# Altium schematic sheet Microprocessor Power.SchDoc
size B; Organization: The Pennsylvania State University - Applied Research Laboratory; DocumentNumber: 8; SheetNumber: 8; SheetTotal: 14; PageSetup: Record=PageOptions|CenterHorizontal=True|CenterVertical=True|PrintScale=0.99|XCorrection=1.00|YCorrection=1.00|PrintKind=1|BorderSize=5000000|LeftOffset=0|BottomOffset=0|Orientation=2|PaperLength=1000|PaperWidth=1000|Scale=100|PaperSource=7|PrintQuality=-4|MediaType=1|DitherType=10|PaperKind=Tabloid (11 x 17")|PrintScaleMode=1; SCHEMATIC_SHEET_TITLE: MICROPROCESSOR POWER; PAGE_TITLE: -
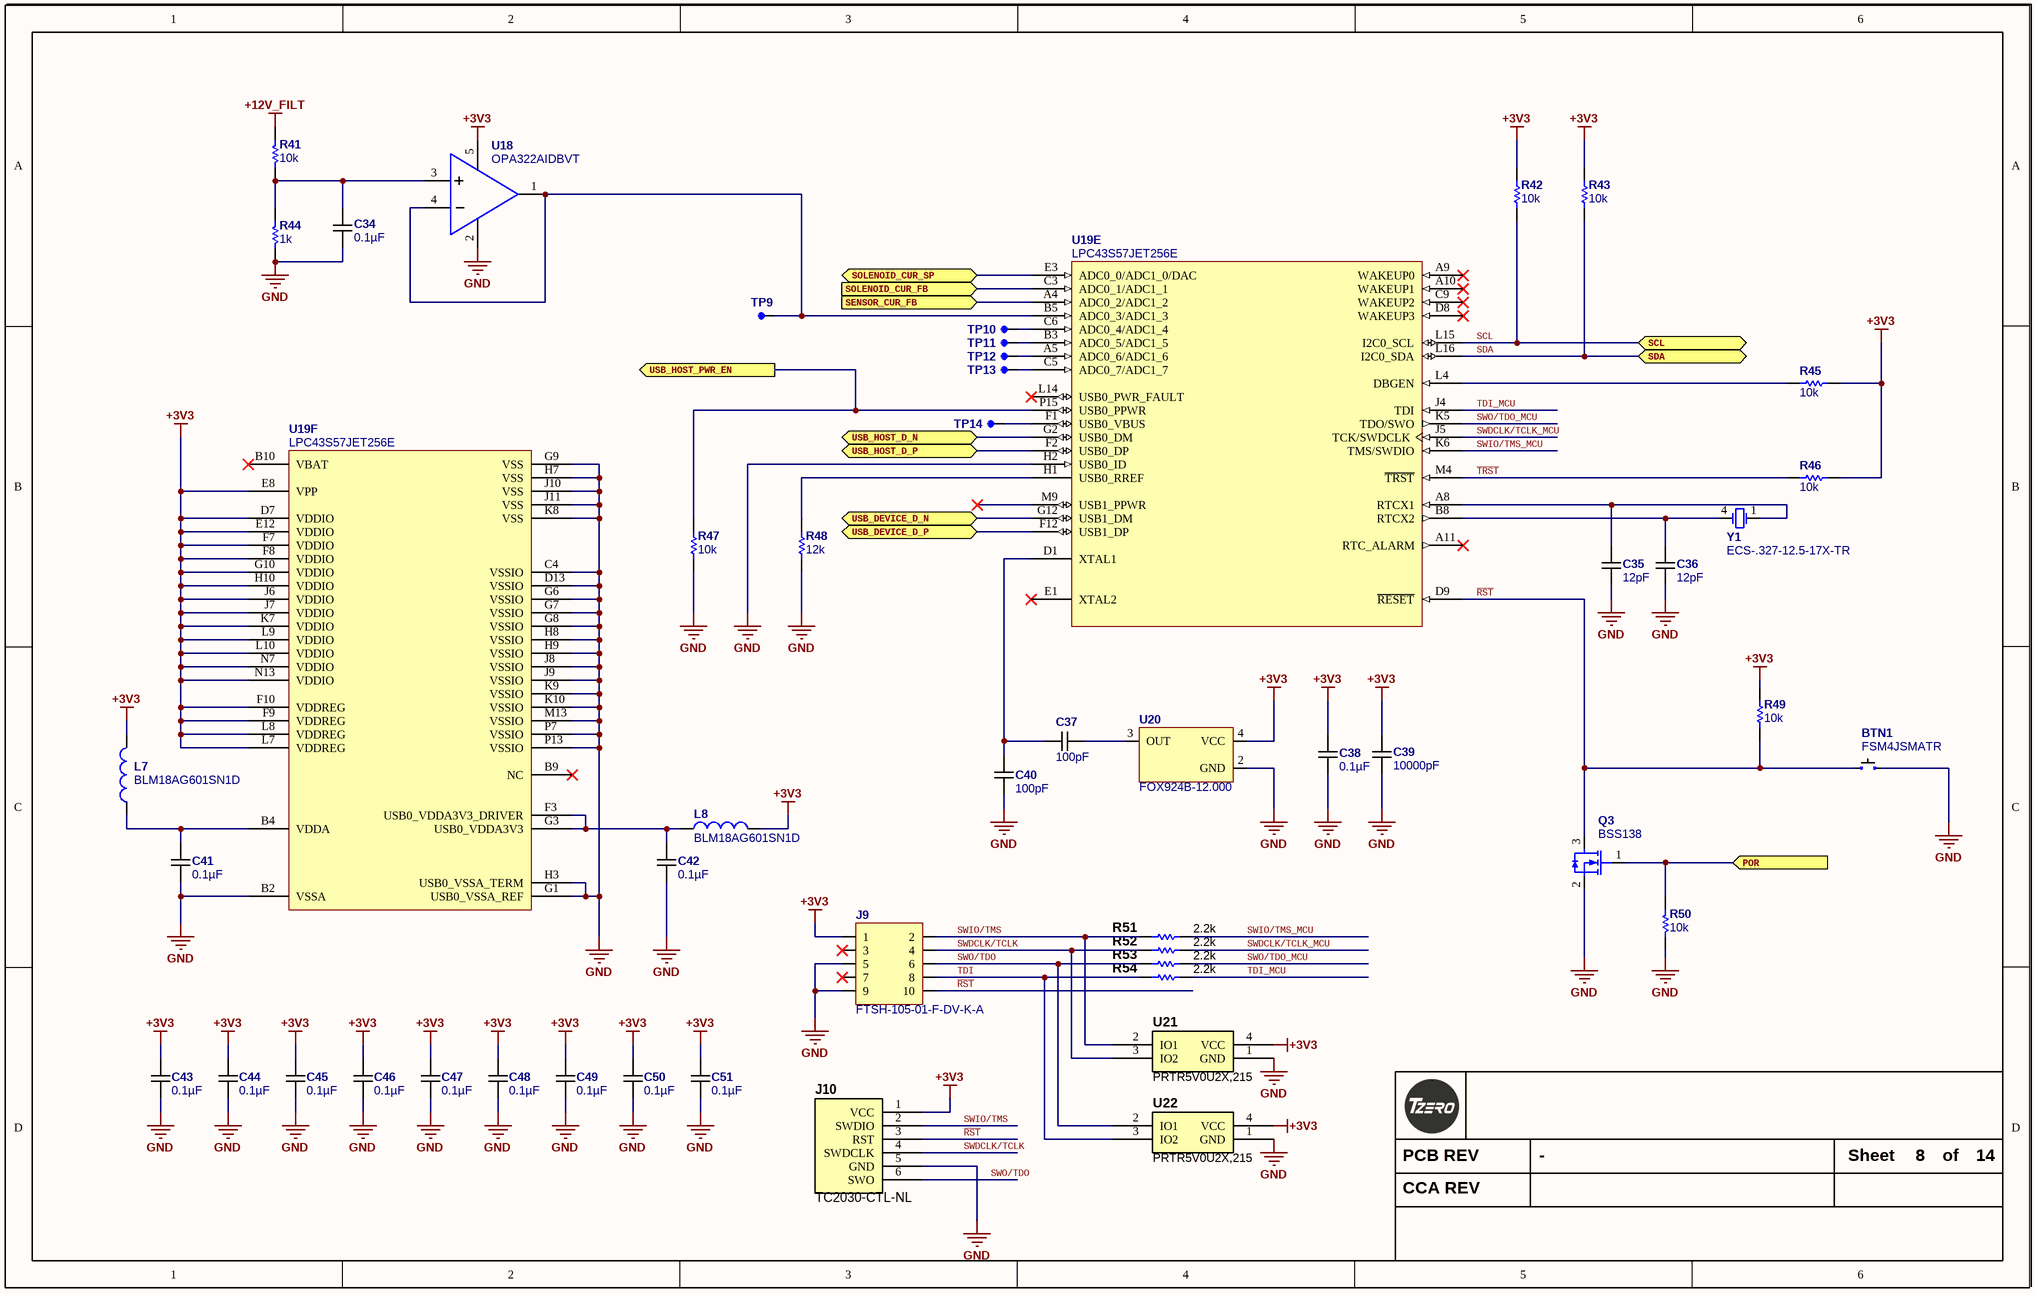
[diagram p0: Microprocessor Power.SchDoc]

## Parts
BTN1  FSM4JSMATR  [FSM4JSMA]
C34  0.1µF  [C0402_0.55MM_HD]
C35  12pF  [C0603_0.90MM_HD]
C36  12pF  [C0603_0.90MM_HD]
C37  100pF  [C0603_0.95MM_HD]
C38  0.1µF  [C0402_0.55MM_HD]
C39  10000pF  [C0603_0.90MM_HD]
C40  100pF  [C0603_0.95MM_HD]
C41  0.1µF  [C0402_0.55MM_HD]
C42  0.1µF  [C0402_0.55MM_HD]
C43  0.1µF  [C0402_0.55MM_HD]
C44  0.1µF  [C0402_0.55MM_HD]
C45  0.1µF  [C0402_0.55MM_HD]
C46  0.1µF  [C0402_0.55MM_HD]
C47  0.1µF  [C0402_0.55MM_HD]
C48  0.1µF  [C0402_0.55MM_HD]
C49  0.1µF  [C0402_0.55MM_HD]
C50  0.1µF  [C0402_0.55MM_HD]
C51  0.1µF  [C0402_0.55MM_HD]
J9  FTSH-105-01-F-DV-K-A  [FTSH-105-01-F-DV-K-A]
J10  TC2030‐CTL‐NL  [TC2030]  (no BOM)
L7  BLM18AG601SN1D  [L_0603_0.8mm]
L8  BLM18AG601SN1D  [L_0603_0.8mm]
Q3  BSS138  [SOT23_Medium]
R41  10k  [R0603_0.55MM_MD]
R42  10k  [R0603_0.55MM_HD]
R43  10k  [R0603_0.55MM_HD]
R44  1k  [R0603_0.55MM_MD]
R45  10k  [R0603_0.55MM_HD]
R46  10k  [R0603_0.55MM_HD]
R47  10k  [R0603_0.55MM_MD]
R48  12k  [R0603_0.55MM_HD]
R49  10k  [R0603_0.55MM_HD]
R50  10k  [R0603_0.55MM_HD]
R51  2.2k  [R0603_0.55MM_MD]
R52  2.2k  [R0603_0.55MM_MD]
R53  2.2k  [R0603_0.55MM_MD]
R54  2.2k  [R0603_0.55MM_MD]
TP9  (no value)  [TP_SMT_25_MIL_ROUND]  (net tie, no BOM)
TP10  (no value)  [TP_SMT_25_MIL_ROUND]  (net tie, no BOM)
TP11  (no value)  [TP_SMT_25_MIL_ROUND]  (net tie, no BOM)
TP12  (no value)  [TP_SMT_25_MIL_ROUND]  (net tie, no BOM)
TP13  (no value)  [TP_SMT_25_MIL_ROUND]  (net tie, no BOM)
TP14  (no value)  [TP_SMT_25_MIL_ROUND]  (net tie, no BOM)
U18  OPA322AIDBVT  [SOT23-5]
U19  LPC43S57JET256E  [LBGA256 16X16 1700X1700X155]  (parts E,F of 10)
U20  FOX924B-12.000  [FOX924]
U21  PRTR5V0U2X,215  [SOT143B]
U22  PRTR5V0U2X,215  [SOT143B]
Y1  ECS-.327-12.5-17X-TR  [ECX-306]

## Ports
POR (in), SCL (bidir), SDA (bidir), SENSOR_CUR_FB (in), SOLENOID_CUR_FB (in), SOLENOID_CUR_SP (bidir), USB_DEVICE_D_N (bidir), USB_DEVICE_D_P (bidir), USB_HOST_D_N (bidir), USB_HOST_D_P (bidir), USB_HOST_PWR_EN (out)

## Nets
+3V3: C38.2 C39.2 C43.2 C44.2 C45.2 C46.2 C47.2 C48.2 C49.2 C50.2 C51.2 J9.1 J10.1(VCC) L7.2 L8.2 R42.1 R43.1 R45.2 R46.2 R49.2 U18.5(VCC) U19.D7(VDDIO) U19.E8(VPP) U19.E12(VDDIO) U19.F7(VDDIO) U19.F8(VDDIO) U19.F9(VDDREG) U19.F10(VDDREG) U19.G10(VDDIO) U19.H10(VDDIO) U19.J6(VDDIO) U19.J7(VDDIO) U19.K7(VDDIO) U19.L7(VDDREG) U19.L8(VDDREG) U19.L9(VDDIO) U19.L10(VDDIO) U19.N7(VDDIO) U19.N13(VDDIO) U20.4(VCC) U21.4(VCC) U22.4(VCC)
+12V_FILT: R41.2
GND: BTN1.B C34.1 C35.1 C36.1 C38.1 C39.1 C40.2 C41.1 C42.1 C43.1 C44.1 C45.1 C46.1 C47.1 C48.1 C49.1 C50.1 C51.1 J9.5 J9.9 J10.5(GND) Q3.2(S) R44.2 R47.2 R48.2 R50.1 U18.2(GND) U19.B2(VSSA) U19.C4(VSSIO) U19.D13(VSSIO) U19.G1(USB0_VSSA_REF) U19.G6(VSSIO) U19.G7(VSSIO) U19.G8(VSSIO) U19.G9(VSS) U19.H2(USB0_ID) U19.H3(USB0_VSSA_TERM) U19.H7(VSS) U19.H8(VSSIO) U19.H9(VSSIO) U19.J8(VSSIO) U19.J9(VSSIO) U19.J10(VSS) U19.J11(VSS) U19.K8(VSS) U19.K9(VSSIO) U19.K10(VSSIO) U19.M13(VSSIO) U19.P7(VSSIO) U19.P13(VSSIO) U20.2(GND) U21.1(GND) U22.1(GND)
~{RST}: BTN1.A J9.10 J10.3(RST) Q3.3(D) R49.1 U19.D9(~{RESET})
~{TRST}: R46.1 U19.M4(~{TRST})
POR: Q3.1(G) R50.2 ; port POR
SCL: R42.2 U19.L15(I2C0_SCL) ; port SCL
SDA: R43.2 U19.L16(I2C0_SDA) ; port SDA
SENSOR_CUR_FB: U19.A4(ADC0_2/ADC1_2) ; port SENSOR_CUR_FB
SOLENOID_CUR_FB: U19.C3(ADC0_1/ADC1_1) ; port SOLENOID_CUR_FB
SOLENOID_CUR_SP: U19.E3(ADC0_0/ADC1_0/DAC) ; port SOLENOID_CUR_SP
SWDCLK/TCLK: J9.4 J10.4(SWDCLK) R52.1 U21.3(IO2)
SWDCLK/TCLK_MCU: R52.2 U19.J5(TCK/SWDCLK)
SWIO/TMS: J9.2 J10.2(SWDIO) R51.1 U21.2(IO1)
SWIO/TMS_MCU: R51.2 U19.K6(TMS/SWDIO)
SWO/TDO: J9.6 J10.6(SWO) R53.1 U22.2(IO1)
SWO/TDO_MCU: R53.2 U19.K5(TDO/SWO)
TDI: J9.8 R54.1 U22.3(IO2)
TDI_MCU: R54.2 U19.J4(TDI)
USB_DEVICE_D_N: U19.G12(USB1_DM) ; port USB_DEVICE_D_N
USB_DEVICE_D_P: U19.F12(USB1_DP) ; port USB_DEVICE_D_P
USB_HOST_D_N: U19.G2(USB0_DM) ; port USB_HOST_D_N
USB_HOST_D_P: U19.F2(USB0_DP) ; port USB_HOST_D_P
USB_HOST_PWR_EN: R47.1 U19.P15(USB0_PPWR) ; port USB_HOST_PWR_EN
NetC34_2: C34.2 R41.1 R44.1 U18.3(+)
NetC35_2: C35.2 U19.A8(RTCX1) Y1.1(OSC1)
NetC36_2: C36.2 U19.B8(RTCX2) Y1.4(OSC2)
NetC37_1: C37.1 U20.3(OUT)
NetC37_2: C37.2 C40.1 U19.D1(XTAL1)
NetC41_2: C41.2 L7.1 U19.B4(VDDA)
NetC42_2: C42.2 L8.1 U19.F3(USB0_VDDA3V3_DRIVER) U19.G3(USB0_VDDA3V3)
NetR45_1: R45.1 U19.L4(DBGEN)
NetR48_1: R48.1 U19.H1(USB0_RREF)
NetTP9_1: TP9.1 U18.1(OUT) U18.4(-) U19.B5(ADC0_3/ADC1_3)
NetTP10_1: TP10.1 U19.C6(ADC0_4/ADC1_4)
NetTP11_1: TP11.1 U19.B3(ADC0_5/ADC1_5)
NetTP12_1: TP12.1 U19.A5(ADC0_6/ADC1_6)
NetTP13_1: TP13.1 U19.C5(ADC0_7/ADC1_7)
NetTP14_1: TP14.1 U19.F1(USB0_VBUS)

Not connected (* = marked no-connect by the designer): J9 3* 7*; U19 A9(WAKEUP0)* A10(WAKEUP1)* A11(RTC_ALARM)* B9(NC)* B10(VBAT)* C9(WAKEUP2)* D8(WAKEUP3)* E1(XTAL2)* L14(USB0_PWR_FAULT)* M9(USB1_PPWR)*

## Notes on the sheet
- PCB REV
- Sheet
- of
- CCA REV

## Library data of the parts
BTN1 = FSM4JSMATR: SWITCH TACTILE SPST-NO 0.05A 12V; Manufacturer: TE Connectivity; Switch Function: Off-Mom; Contact Rating @ Voltage: 0.05A @ 12VDC; Actuator Type: Standard; Actuator Orientation: Top Actuated; Outline: 6.00mm x 6.00mm; Illumination: Non-Illuminated; Operating Force: 160gf; Supplier 1: Digi-Key; Supplier Part Number 1: 450-1759-1-ND; Manufacturer Part Number: FSM4JSMATR; RoHS: RoHS Compliant; Category: Switches; Stock 1: 35617; Pricing 1: 1=0.36, 10=0.34, 25=0.2912, 50=0.2474, 100=0.2377, 250=0.21344, 500=0.20374 (USD); Circuit: SPST-NO; Mounting Type: Surface Mount; Termination Style: Gull Wing; Packaging: Cut Tape (CT); ComponentLink1URL: http://documents.tycoelectronics.com/commerce/DocumentDelivery/DDEController?Action=srchrtrv&DocNm=2-1437565-7&DocType=CD&DocLang=EN; ComponentLink1Description: http://documents.tycoelectronics.com/commerce/DocumentDelivery/DDEController?Action=srchrtrv&DocNm=2-1437565-7&DocType=CD&DocLang=EN; Value: FSM4JSMATR
C34 C38 C41-C51 = CGA2B3X7R1E104K050BB: CAP CER 0.1UF 25V X7R 0402; Manufacturer: TDK Corporation; Tolerance: ±10%; Substitution Notes: 0.1µF , 25V , ±10% , X7R , -55°C ~ 125°C , AEC-Q200 , 0402; Value: 0.1µF; Temperature Coefficient: X7R; Manufacturer Part Number: CGA2B3X7R1E104K050BB; ComponentLink1Description: Datasheet (Internal); ComponentLink1URL: datasheets\TDK\mlcc_automotive_general_en.pdf; ComponentLink2Description: Datasheet (External); ComponentLink2URL: https://product.tdk.com/info/en/catalog/datasheets/mlcc_automotive_general_en.pdf; Supplier 1: Digikey; Supplier Part Number 1: 445-6902-1-ND; Category: Capacitors; Voltage - Rated: 25V; Features: -; Operating Temperature: -55°C ~ 125°C; Ratings: AEC-Q200; Package: 0402; Thickness (Max): 0.55MM
C35 C36 = CGA3E2C0G1H120J080AA: CAP CER 12PF 50V C0G 0603; Manufacturer: TDK Corporation; Temperature Coefficient: C0G, NP0; Tolerance: ±5%; Substitution Notes: 12pF , 50V , ±5% , C0G, NP0 , -55°C ~ 125°C , AEC-Q200 , 0603; Value: 12pF; Manufacturer Part Number: CGA3E2C0G1H120J080AA; ComponentLink1Description: Datasheet (Internal); ComponentLink1URL: datasheets\TDK\mlcc_automotive_general_en.pdf; ComponentLink2Description: Datasheet (External); ComponentLink2URL: https://product.tdk.com/info/en/catalog/datasheets/mlcc_automotive_general_en.pdf; Supplier 1: Digikey; Supplier Part Number 1: 445-5629-1-ND; Category: Capacitors; Voltage - Rated: 50V; Operating Temperature: -55°C ~ 125°C; Ratings: AEC-Q200; Package: 0603; Thickness (Max): 0.90MM; Features: -
C37 C40 = CGA3E2C0G1H101J080AE: CAP CER 100PF 50V NP0 0603; Manufacturer: TDK Corporation; Temperature Coefficient: C0G, NP0; Tolerance: ±5%; Substitution Notes: 100pF , 50V , ±5% , C0G, NP0 , -55°C ~ 125°C , AEC-Q200 , 0603; Value: 100pF; Manufacturer Part Number: CGA3E2C0G1H101J080AE; ComponentLink1Description: Datasheet (Internal); ComponentLink1URL: datasheets\TDK\mlcc_automotive_general_en.pdf; ComponentLink2Description: Datasheet (External); ComponentLink2URL: https://product.tdk.com/info/en/catalog/datasheets/mlcc_automotive_general_en.pdf; Supplier 1: Digikey; Supplier Part Number 1: 445-173653-1-ND; Category: Capacitors; Voltage - Rated: 50V; Operating Temperature: -55°C ~ 125°C; Ratings: AEC-Q200; Package: 0603; Thickness (Max): 0.95MM; Features: Soft Termination
C39 = CGA3E2C0G1H103J080AA: CAP CER 10000PF 50V C0G 0603; Manufacturer: TDK Corporation; Temperature Coefficient: C0G, NP0; Tolerance: ±5%; Substitution Notes: 10000pF , 50V , ±5% , C0G, NP0 , -55°C ~ 125°C , AEC-Q200 , 0603; Value: 10000pF; Manufacturer Part Number: CGA3E2C0G1H103J080AA; ComponentLink1Description: Datasheet (Internal); ComponentLink1URL: datasheets\TDK\mlcc_automotive_general_en.pdf; ComponentLink2Description: Datasheet (External); ComponentLink2URL: https://product.tdk.com/info/en/catalog/datasheets/mlcc_automotive_general_en.pdf; Supplier 1: Digikey; Supplier Part Number 1: 445-6916-1-ND; Category: Capacitors; Voltage - Rated: 50V; Features: -; Operating Temperature: -55°C ~ 125°C; Ratings: AEC-Q200; Package: 0603; Thickness (Max): 0.90MM
J9 = FTSH-105-01-F-DV-K-A: CONN HEADER 10POS DUAL .05" SMD; Manufacturer: Samtec Inc; CategorySort: 800; Connector Type: Header, Unshrouded; Number of Positions: 10; Number of Positions Loaded: All; Pitch: 0.050" (1.27mm); Value: FTSH-105-01-F-DV-K-A; Sort Value: *; Category: Connectors; Supplier 1: Digi-Key; Supplier Part Number 1: FTSH-105-01-F-DV-K-A-ND; Manufacturer Part Number: FTSH-105-01-F-DV-K-A; RoHS: RoHS Compliant; Stock 1: 0; Pricing 1: 1=3.59 (USD); Packaging: Tube; Contact Type: Male Pin; Number of Rows: 2; Row Spacing: 0.050" (1.27mm); Contact Mating Length: 0.120" (3.05mm); Mounting Type: Surface Mount; Termination: Solder; Fastening Type: -; Features: -; Contact Finish: Gold; Contact Finish Thickness: 3µin (0.08µm); Color: Black; ComponentLink1URL: http://www.samtec.com/documents/webfiles/cpdf/FTSH-1XX-XX-XXX-DV-XXX-MKT.pdf; ComponentLink1Description: http://www.samtec.com/documents/webfiles/cpdf/FTSH-1XX-XX-XXX-DV-XXX-MKT.pdf
J10 = TC2030‐CTL‐NL: Tag Connect Pads - No latching Clips - ARM; Value: TC2030‐CTL‐NL
L7 L8 = BLM18AG601SN1D: FERRITE CHIP 600 OHM 500MA 0603; Manufacturer: Murata Electronics North America; CategorySort: 300; Impedance @ Frequency: 600 Ohm @ 100MHz; DC Resistance (DCR): 380 mOhm Max; Filter Type: Differential Mode - Single; Value: BLM18AG601SN1D; Sort Value: *; Category: Inductors; Supplier 1: Digi-Key; Supplier Part Number 1: 490-1014-1-ND; Manufacturer Part Number: BLM18AG601SN1D; RoHS: RoHS Compliant; Stock 1: 139441; Pricing 1: 1=0.1, 10=0.079, 50=0.0648, 100=0.0476, 250=0.0346, 500=0.0317, 1000=0.02738 (USD); Current Rating: 500mA; Package: 0603 (1608 Metric); Mounting Type: Surface Mount; Packaging: Cut Tape (CT); Height (Max): 0.037" (0.95mm); Size / Dimension: 0.063" L x 0.031" W (1.60mm x 0.80mm); ComponentLink1URL: http://search.murata.co.jp/Ceramy/image/img/PDF/ENG/L0110S0100BLM18A.pdf; ComponentLink1Description: http://search.murata.co.jp/Ceramy/image/img/PDF/ENG/L0110S0100BLM18A.pdf
Q3 = BSS138: FAIRCHILD SEMICONDUCTOR - BSS138 - N CHANNEL MOSFET, 50V, 220mA SOT-23; CategorySort: 500; Value: BSS138; Sort Value: *; Category: Semiconductors; Supplier 1: Newark; Manufacturer: FAIRCHILD SEMICONDUCTOR; Manufacturer Part Number: BSS138; RoHS: YES; Stock 1: 17000; Pricing 1: 1=0.077, 25=0.064, 100=0.049, 250=0.039, 500=0.035, 1000=0.03 (USD); ComponentLink1URL: http://www.fairchildsemi.com/ds/BS/BSS138.pdf; ComponentLink1Description: http://www.fairchildsemi.com/ds/BS/BSS138.pdf; Supplier Part Number 1: 58K8769; Package: SOT-23
R41 R50 = ERJ-3EKF1002V: RES 10K OHM 1/10W 1% 0603 SMD; Manufacturer: Panasonic Electronic Components; Package Power: 0603  (0.1W); Power (Watts): 0.1W- 1/10W; Temperature Coefficient: ±100ppm/°C; Limiting Element Voltage: 75; Maximum Overload Voltage: 150; Maximum Working Voltage: 31.6V; Substitution Notes: 10k , ±1% , 0603 , AEC-Q200; Value: 10k; Manufacturer Part Number: ERJ-3EKF1002V; ComponentLink1Description: Internal Datasheet; ComponentLink1URL: datasheets\Panasonic Electronic Components\AOA0000CE2.pdf; ComponentLink2Description: External Datasheet; ComponentLink2URL: http://industrial.panasonic.com/www-data/pdf/AOA0000/AOA0000CE2.pdf; Supplier 1: Digi-Key; Supplier Part Number 1: P10.0KHCT-ND; Category: Resistors; Resistance (Ohms): 10k; Composition: Thick Film; Features: -; Tolerance: ±1%; Package: 0603 (1608 Metric); Supplier Package: 0603; Size / Dimension: 0.063" L x 0.031" W (1.60mm x 0.80mm); Height: 0.55MM; Number of Terminations: 2; Packaging: Cut Tape (CT); Sort Value: 10000; Sort Value Package: 603_10000; Ratings: AEC-Q200
R42 R43 R45-R47 R49 = ERJ-3EKF1002V: RES 10K OHM 1/10W 1% 0603 SMD; Manufacturer: Panasonic Electronic Components; Power (Watts): 0.1W- 1/10W; Temperature Coefficient: ±100ppm/°C; Package Power: 0603  (0.1W); Limiting Element Voltage: 75; Maximum Overload Voltage: 150; Maximum Working Voltage: 31.6V; Substitution Notes: 10k , ±1% , 0603 , AEC-Q200; Value: 10k; Supplier 1: Digi-Key; Supplier Part Number 1: P10.0KHCT-ND; Manufacturer Part Number: ERJ-3EKF1002V; Category: Resistors; Sort Value: 10000; Composition: Thick Film; Features: -; Tolerance: ±1%; Package: 0603 (1608 Metric); Size / Dimension: 0.063" L x 0.031" W (1.60mm x 0.80mm); Height: 0.55MM; Packaging: Cut Tape (CT); ComponentLink1URL: datasheets\Panasonic Electronic Components\AOA0000CE2.pdf; ComponentLink1Description: Internal Datasheet; ComponentLink2Description: External Datasheet; ComponentLink2URL: http://industrial.panasonic.com/www-data/pdf/AOA0000/AOA0000CE2.pdf; Resistance (Ohms): 10k; Supplier Package: 0603; Number of Terminations: 2; Sort Value Package: 603_10000; Ratings: AEC-Q200
R44 = ERJ-3EKF1001V: RES 1K OHM 1/10W 1% 0603 SMD; Manufacturer: Panasonic Electronic Components; Package Power: 0603  (0.1W); Power (Watts): 0.1W- 1/10W; Temperature Coefficient: ±100ppm/°C; Limiting Element Voltage: 75; Maximum Overload Voltage: 150; Maximum Working Voltage: 10.0V; Substitution Notes: 1k , ±1% , 0603 , AEC-Q200; Value: 1k; Manufacturer Part Number: ERJ-3EKF1001V; ComponentLink1Description: Internal Datasheet; ComponentLink1URL: datasheets\Panasonic Electronic Components\AOA0000CE2.pdf; ComponentLink2Description: External Datasheet; ComponentLink2URL: http://industrial.panasonic.com/www-data/pdf/AOA0000/AOA0000CE2.pdf; Supplier 1: Digi-Key; Supplier Part Number 1: P1.00KHCT-ND; Category: Resistors; Resistance (Ohms): 1k; Composition: Thick Film; Features: -; Tolerance: ±1%; Package: 0603 (1608 Metric); Supplier Package: 0603; Size / Dimension: 0.063" L x 0.031" W (1.60mm x 0.80mm); Height: 0.55MM; Number of Terminations: 2; Packaging: Cut Tape (CT); Sort Value: 1000; Sort Value Package: 603_1000; Ratings: AEC-Q200
R48 = ERJ-3EKF1202V: RES 12K OHM 1/10W 1% 0603 SMD; Manufacturer: Panasonic Electronic Components; Power (Watts): 0.1W- 1/10W; Temperature Coefficient: ±100ppm/°C; Package Power: 0603  (0.1W); Limiting Element Voltage: 75; Maximum Overload Voltage: 150; Maximum Working Voltage: 34.6V; Substitution Notes: 12k , ±1% , 0603 , AEC-Q200; Value: 12k; Supplier 1: Digi-Key; Supplier Part Number 1: P12.0KHCT-ND; Manufacturer Part Number: ERJ-3EKF1202V; Category: Resistors; Sort Value: 12000; Composition: Thick Film; Features: -; Tolerance: ±1%; Package: 0603 (1608 Metric); Size / Dimension: 0.063" L x 0.031" W (1.60mm x 0.80mm); Height: 0.55MM; Packaging: Cut Tape (CT); ComponentLink1URL: datasheets\Panasonic Electronic Components\AOA0000CE2.pdf; ComponentLink1Description: Internal Datasheet; ComponentLink2Description: External Datasheet; ComponentLink2URL: http://industrial.panasonic.com/www-data/pdf/AOA0000/AOA0000CE2.pdf; Resistance (Ohms): 12k; Supplier Package: 0603; Number of Terminations: 2; Sort Value Package: 603_12000; Ratings: AEC-Q200
R51-R54 = ERJ-3EKF2201V: RES 2.2K OHM 1/10W 1% 0603 SMD; Manufacturer: Panasonic Electronic Components; Package Power: 0603  (0.1W); Power (Watts): 0.1W- 1/10W; Temperature Coefficient: ±100ppm/°C; Limiting Element Voltage: 75; Maximum Overload Voltage: 150; Maximum Working Voltage: 14.8V; Substitution Notes: 2.2k , ±1% , 0603 , AEC-Q200; Value: 2.2k; Manufacturer Part Number: ERJ-3EKF2201V; ComponentLink1Description: Internal Datasheet; ComponentLink1URL: datasheets\Panasonic Electronic Components\AOA0000CE2.pdf; ComponentLink2Description: External Datasheet; ComponentLink2URL: http://industrial.panasonic.com/www-data/pdf/AOA0000/AOA0000CE2.pdf; Supplier 1: Digi-Key; Supplier Part Number 1: P2.20KHCT-ND; Category: Resistors; Resistance (Ohms): 2.2k; Composition: Thick Film; Features: -; Tolerance: ±1%; Package: 0603 (1608 Metric); Supplier Package: 0603; Size / Dimension: 0.063" L x 0.031" W (1.60mm x 0.80mm); Height: 0.55MM; Number of Terminations: 2; Packaging: Cut Tape (CT); Sort Value: 2200; Sort Value Package: 603_2200; Ratings: AEC-Q200
TP9-TP14 = TP SMT 25MIL: Sort Value: *; Category: *; CategorySort: *
U18 = OPA322AIDBVT: IC OPAMP GP 20MHZ RRO SOT23-5; Manufacturer: Texas Instruments; Number of Channels: 1; Min Supply Voltage: 1.8V; Max Supply Voltage: 5.5V; Slew Rate: 10V/µs; Input Bias Current: 10pA; Input Offset Voltage (Vos): 2mV; Voltage Gain: 130dB; Common Mode Rejection Ratio: 90dB; Operating Supply Current: 1.6mA; Nominal Supply Current: 1.5mA; Output Current per Channel: 65mA; Min Dual Supply Voltage: 900mV; Max Dual Supply Voltage: 2.75V; Power Supply Rejection Ratio (PSRR): 100dB; Max Frequency: 10MHz; Manufacturer Part Number: OPA322AIDBVT; Value: OPA322AIDBVT; Supplier 1: Digi-Key; Supplier Part Number 1: 296-29511-1-ND; RoHS: Yes; Category: Amplifiers - Op Amps, Buffer, Instrumentation; Stock: 3683; Pricing: 1=1.66000, 10=1.49500, 25=1.41000, 100=1.12800 (USD); Case/Package: SOT-23; Number of Pins: 5; Min Operating Temperature: -40°C; Max Operating Temperature: 125°C; Packaging: Tape and Reel; Package Quantity: 250; Number of Circuits: 1; Gain Bandwidth Product: 20MHz; Unity Gain Bandwidth Product: 20MHz; Number of Elements: 1; Max I/O Voltage: 2mV; Nominal Gain Bandwidth Product: 20MHz; Output Current: 65mA; Bandwidth: 20MHz; Number of Amplifiers: 1; Operating Supply Voltage: 2.75V; Length: 3.05mm; Height: 1.3mm; Width: 1.75mm; Radiation Hardening: No; Lead Free: Lead Free; REACH SVHC: No SVHC; ComponentLink1URL: https://datasheet.ciiva.com/1803/opa322-1803459.pdf?src-supplier=Digi-Key; ComponentLink1Description: https://datasheet.ciiva.com/1803/opa322-1803459.pdf?src-supplier=Digi-Key; ComponentLink2URL: https://datasheet.ciiva.com/7848/1481239-7848179.pdf?src-supplier=Element14; ComponentLink2Description: https://datasheet.ciiva.com/7848/1481239-7848179.pdf?src-supplier=Element14; ComponentLink3URL: https://datasheet.ciiva.com/1803/opa322-1803460.pdf?src-supplier=Digi-Key; ComponentLink3Description: https://datasheet.ciiva.com/1803/opa322-1803460.pdf?src-supplier=Digi-Key; ComponentLink4URL: https://datasheet.ciiva.com/1803/opa322-1803461.pdf?src-supplier=Digi-Key; ComponentLink4Description: https://datasheet.ciiva.com/1803/opa322-1803461.pdf?src-supplier=Digi-Key; ComponentLink5URL: https://datasheet.ciiva.com/14460/opa4322-14460092.pdf?src-supplier=Avnet; ComponentLink5Description: https://datasheet.ciiva.com/14460/opa4322-14460092.pdf?src-supplier=Avnet; ComponentLink6URL: https://datasheet.ciiva.com/48706/001071938-da-01-en-ic-opamp-gp-rr-opa322aidbvt-sot-23-5-tid-48706602.pdf?src-supplier=Conrad; ComponentLink6Description: https://datasheet.ciiva.com/48706/001071938-da-01-en-ic-opamp-gp-rr-opa322aidbvt-sot-23-5-tid-48706602.pdf?src-supplier=Conrad
U19 = LPC43S57JET256E: ARM Microcontrollers - MCU CortexM0/4 32bit 1MB Cortex-M4/M0; Manufacturer: NXP Semiconductors; CategorySort: 600; Data RAM Size: 136 KB; Core: ARM Cortex M4/M0; Maximum Clock Frequency: 204 MHz; On-Chip ADC: Yes; Operating Supply Voltage: 2.2 V to 3.6 V; Processor Series: LPC4357; Product Status: New Technology; Value: LPC43S57JET256E; Sort Value: *; Category: Integrated Circuits; Supplier 1: Digi-Key; Supplier Part Number 1: 568-11712-ND; Manufacturer Part Number: LPC43S57JET256E; RoHS: RoHS Compliant; Stock 1: 108; Pricing 1: 1=14.40, 25=13.31, 100=12.24, 250=11.16, 500=10.43, 1000=9.57 (USD); Package: LBGA-256; Packaging: Tray; Mounting Style: SMD/SMT; Program Memory Size: 1 MB; Data Bus Width: 32 bit; Maximum Operating Temperature: + 85 C; Minimum Operating Temperature: - 40 C; Standard Pack Qty: 90; Tradename: LPC; RoHS - Mouser: Y; Minimum Order Quantity: 1; Reeling: False; ComponentLink1URL: http://www.nxp.com/documents/data_sheet/LPC4357_53_37_33.pdf; ComponentLink1Description: http://www.nxp.com/documents/data_sheet/LPC4357_53_37_33.pdf
U20 = FOX924B-12.000: OSC TCXO 12.00MHZ HCMOS SMD; Manufacturer: Fox Electronics; CategorySort: 600; Frequency: 12MHz; Voltage - Supply: 3.3V; Frequency Stability: ±2.5ppm; Current - Supply (Max): 6mA; Value: FOX924B-12.000; Sort Value: *; Category: Integrated Circuits; Supplier 1: Digi-Key; Supplier Part Number 1: 631-1068-1-ND; Manufacturer Part Number: FOX924B-12.000; RoHS: RoHS Compliant; Stock 1: 2663; Pricing 1: 1=3.76, 10=3.591, 50=3.403, 100=3.0438, 500=2.8728 (USD); Type: TCXO; Function: -; Output: HCMOS; Operating Temperature: -30°C ~ 85°C; Ratings: -; Mounting Type: Surface Mount; Size / Dimension: 0.197" L x 0.126" W (5.00mm x 3.20mm); Height: 0.059" (1.50mm); Package: 4-SMD, No Lead (DFN, LCC); Packaging: Cut Tape (CT); Current - Supply (Disable) (Max): -; ComponentLink1URL: http://www.foxonline.com/pdfs/fox924.pdf; ComponentLink1Description: http://www.foxonline.com/pdfs/fox924.pdf
U21 U22 = PRTR5V0U2X,215: TVS DIODE 5.5VWM SOT143B; Manufacturer: NXP Semiconductors; Bidirectional Channels: 2; Voltage - Reverse Standoff (Typ): 5.5V (Max); Voltage - Breakdown (Min): 6V; Power Line Protection: Yes; Capacitance @ Frequency: 1pF @ 1MHz; Supplier 1: Digi-Key; Supplier Part Number 1: 568-4140-1-ND; Manufacturer Part Number: PRTR5V0U2X,215; RoHS: RoHS Compliant; Category: Circuit Protection; Stock: 11734; Pricing: 1=0.57, 10=0.477, 25=0.418, 100=0.3578, 250=0.31036, 500=0.26286, 1000=0.20265 (USD); Packaging: Cut Tape (CT); Type: Steering (Rail to Rail); Unidirectional Channels: -; Voltage - Clamping (Max) @ Ipp: -; Current - Peak Pulse (10/1000µs): -; Power - Peak Pulse: -; Applications: General Purpose; Operating Temperature: -40°C ~ 85°C (TA); Mounting Type: Surface Mount; Package / Case: TO-253-4, TO-253AA; Supplier Device Package: SOT-143B; ComponentLink1URL: http://www.nxp.com/documents/data_sheet/PRTR5V0U2X.pdf; ComponentLink1Description: http://www.nxp.com/documents/data_sheet/PRTR5V0U2X.pdf; Value: PRTR5V0U2X,215
Y1 = ECS-.327-12.5-17X-TR: CRYSTAL 32.768KHZ 12.5PF SMD; Manufacturer: ECS Inc; CategorySort: 600; Frequency Tolerance: ±20ppm; ESR (Equivalent Series Resistance): 50 kOhm; Operating Mode: Fundamental; Value: ECS-.327-12.5-17X-TR; Sort Value: *; Category: Integrated Circuits; Supplier 1: Digi-Key; Supplier Part Number 1: XC1195CT-ND; Manufacturer Part Number: ECS-.327-12.5-17X-TR; RoHS: RoHS Compliant; Stock 1: 17619; Pricing 1: 1=1.31, 10=1.138, 50=0.9976, 100=0.7875, 500=0.665, 1000=0.525 (USD); Packaging: Cut Tape (CT); Type: kHz Crystal (Tuning Fork); Frequency: 32.768kHz; Frequency Stability: -; Load Capacitance: 12.5pF; Operating Temperature: -40°C ~ 85°C; Ratings: -; Mounting Type: Surface Mount; Package: 4-SOJ, 5.50mm pitch; Size / Dimension: 0.315" L x 0.150" W (8.00mm x 3.80mm); Height: 0.098" (2.50mm); ComponentLink1URL: http://www.ecsxtal.com/store/pdf/ecx-306x.pdf; ComponentLink1Description: http://www.ecsxtal.com/store/pdf/ecx-306x.pdf